# Altium project Micropro_20232.PrjPCB
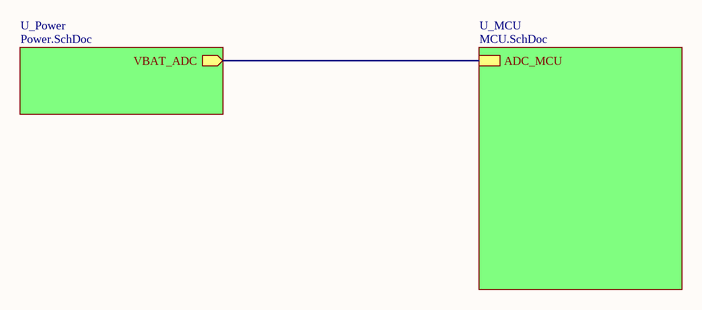
[diagram p0: Mutisheet.SchDoc]
3 sheets, 43 parts. Net scope: hierarchical (ports join the sheet entries above them; power ports are global).
Board file: PCB1.PcbDoc
Sheets:
  Mutisheet.SchDoc
    U_MCU = MCU.SchDoc
    U_Power = Power.SchDoc

## Sheet Mutisheet.SchDoc
size B

### Sub-sheets
U_MCU = MCU.SchDoc: ADC_MCU
U_Power = Power.SchDoc: VBAT_ADC (out)

### Nets
D13_MCU: sheet U_MCU/ADC_MCU, sheet U_Power/VBAT_ADC

## Sheet MCU.SchDoc
size A
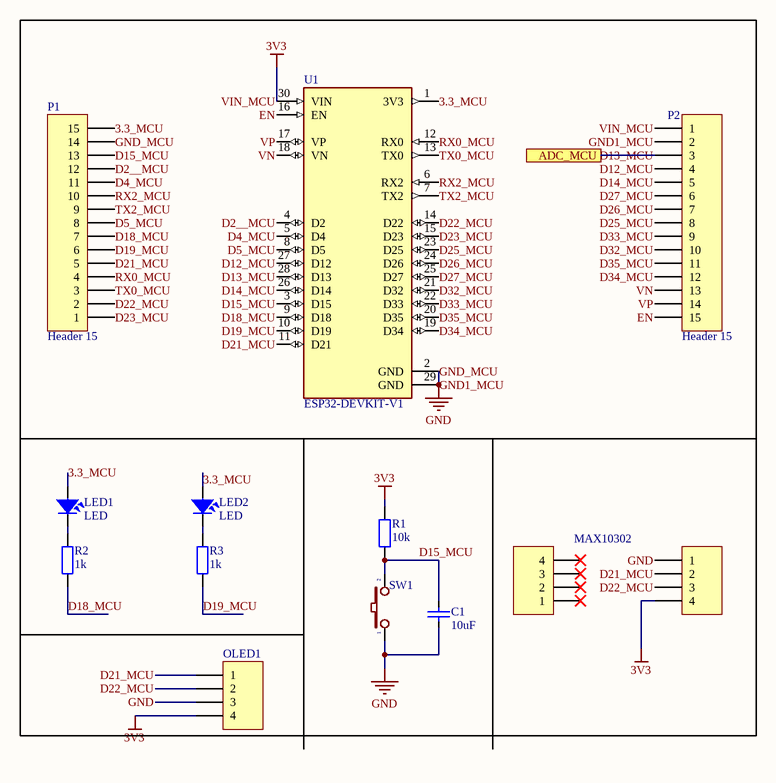
[diagram p1: MCU.SchDoc]

### Parts
C1  10uF  [CAP_0805]
LED1  LED  [LED-0805-Blue]
LED2  LED  [LED-0805-Blue]
MAX10302  Header 4  [HDR1X4]  (value not drawn)
OLED1  LCD  [HDR1X4]  (value not drawn)
P1  Header 15  [HDR1X15]
P2  Header 15  [HDR1X15]
P3  Header 4  [HDR1X4]  (value not drawn)
R1  10k  [RES-SMD-0805]
R2  1k  [RES-SMD-0805]
R3  1k  [RES-SMD-0805]
SW1  SW  [SW2]  (value not drawn)
U1  ESP32-DEVKIT-V1  [MODULE_ESP32_DEVKIT_V1]

### Ports
ADC_MCU

### Nets
GND: C1.1 MAX10302.1 OLED1.3 P1.14 P2.2 SW1.1 U1.2(GND) U1.29(GND)  [also labelled GND1_MCU, GND_MCU]
VIN_MCU: MAX10302.4 OLED1.4 P2.1 R1.1 U1.30(VIN)  [also labelled 3V3]
3.3_MCU: LED1.1 LED2.1 P1.15 U1.1(3V3)
D2__MCU: P1.12 U1.4(D2)
D4_MCU: P1.11 U1.5(D4)
D5_MCU: P1.8 U1.8(D5)
D12_MCU: P2.4 U1.27(D12)
D13_MCU: P2.3 U1.28(D13) ; port ADC_MCU
D14_MCU: P2.5 U1.26(D14)
D15_MCU: C1.2 P1.13 R1.2 SW1.2 U1.3(D15)
D18_MCU: P1.7 R2.2 U1.9(D18)
D19_MCU: P1.6 R3.2 U1.10(D19)
D21_MCU: MAX10302.2 OLED1.1 P1.5 U1.11(D21)
D22_MCU: MAX10302.3 OLED1.2 P1.2 U1.14(D22)
D23_MCU: P1.1 U1.15(D23)
D25_MCU: P2.8 U1.23(D25)
D26_MCU: P2.7 U1.24(D26)
D27_MCU: P2.6 U1.25(D27)
D32_MCU: P2.10 U1.21(D32)
D33_MCU: P2.9 U1.22(D33)
D34_MCU: P2.12 U1.19(D34)
D35_MCU: P2.11 U1.20(D35)
EN: P2.15 U1.16(EN)
RX0_MCU: P1.4 U1.12(RX0)
RX2_MCU: P1.10 U1.6(RX2)
TX0_MCU: P1.3 U1.13(TX0)
TX2_MCU: P1.9 U1.7(TX2)
VN: P2.13 U1.18(VN)
VP: P2.14 U1.17(VP)
NetLED1_2: LED1.2 R2.1
NetLED2_2: LED2.2 R3.1

Not connected (* = marked no-connect by the designer): P3 1* 2* 3* 4*

### Library data of the parts
C1 = CapSMD: Capacitor; Value: 33p; Published: 8-Jun-2000; LatestRevisionDate: 17-Jul-2002; LatestRevisionNote: Re-released for DXP Platform.; PackageReference: RAD-0.3; Publisher: Altium Limited
LED1 LED2 = LED: LED Single colour Green and Red; Value: LED 3 ly Single Colour
MAX10302 OLED1 P3 = Header 4: Header, 4-Pin; LatestRevisionDate: 17-Jul-2002; LatestRevisionNote: Re-released for DXP Platform.; Publisher: Altium Limited
P1 P2 = Header 15: Header, 15-Pin; LatestRevisionDate: 17-Jul-2002; LatestRevisionNote: Re-released for DXP Platform.; Publisher: Altium Limited
R1-R3 = Resistor - SMD: Resistor SMD; Manufacturer: Generic Components; Class: Passive; Published: 08/06/2000; Publisher: Altium Hobart Technology Centre
SW1 = SW2: Switch button 2 pin; Value: SW chip 2 pin
U1 = ESP32-DEVKIT-V1: Dual core, Wi-Fi: 2.4 GHz up to 150 Mbits/s,BLE (Bluetooth Low Energy) and legacy Bluetooth, 32 bits, Up to 240 MHz; MF: Do it; Price: None; Availability: Not in stock; Package: None; MP: ESP32-DEVKIT-V1; Value: *; SnapEDA_Link: https://www.snapeda.com/parts/ESP32-DEVKIT-V1/Do+it/view-part/?ref=snap; Check_prices: https://www.snapeda.com/parts/ESP32-DEVKIT-V1/Do+it/view-part/?ref=eda

## Sheet Power.SchDoc
size B
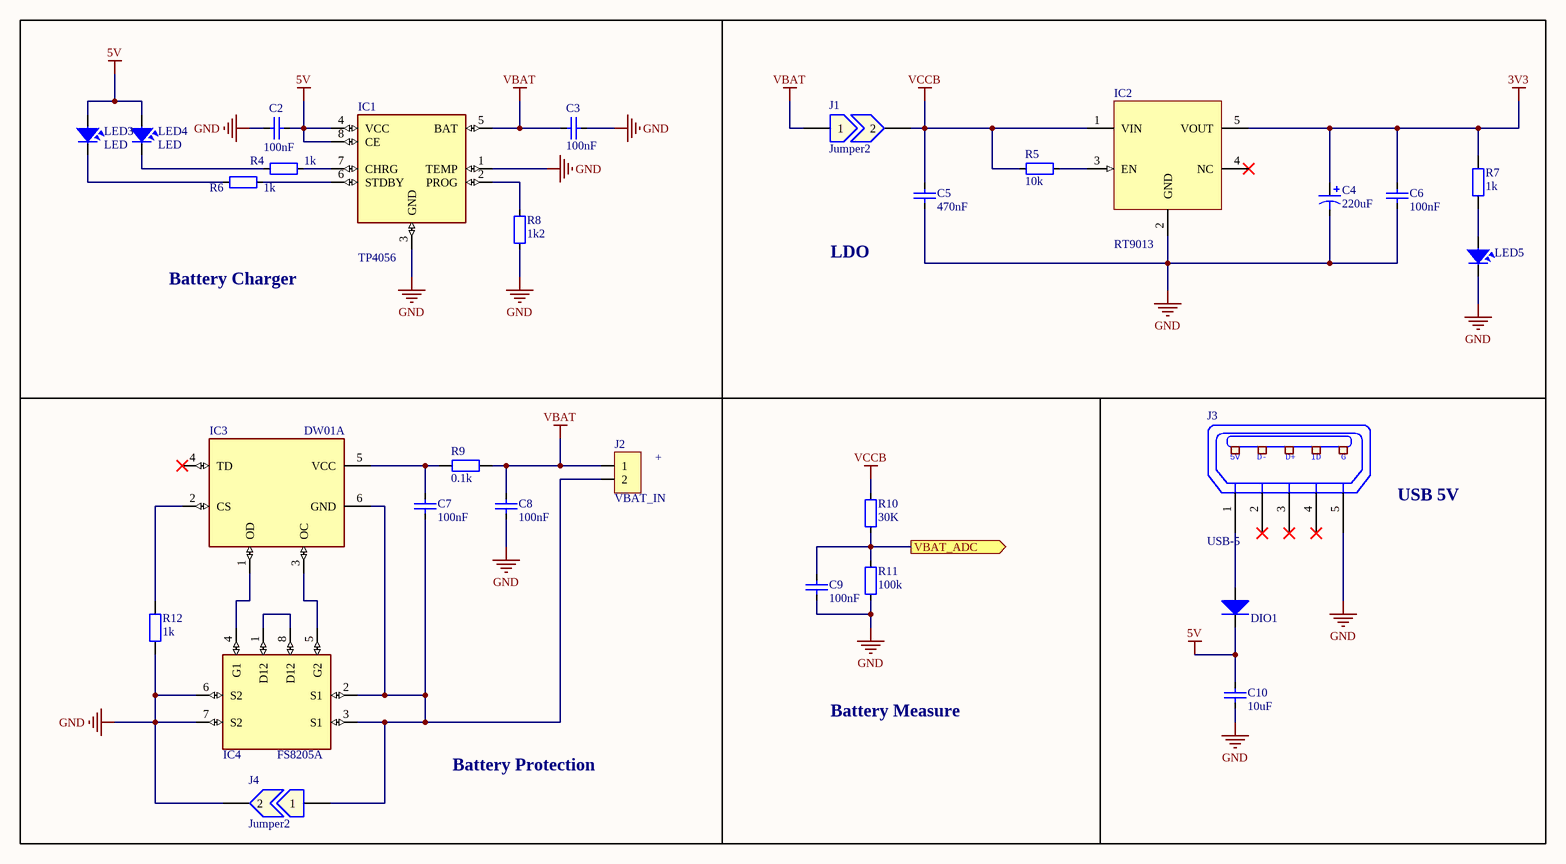
[diagram p2: Power.SchDoc]

### Parts
C2  100nF  [CAP_0805]
C3  100nF  [CAP_0805]
C4  220uF  [CAP_TANTALUM_3216]
C5  470nF  [CAP_0805]
C6  100nF  [CAP_0805]
C7  100nF  [CAP_0805]
C8  100nF  [CAP_0805]
C9  100nF  [CAP_0805]
C10  10uF  [CAP_0805]
DIO1  Diode SMD  [DIO-214AC(SMA)]  (value not drawn)
IC1  TP4056  [TP4056]
IC2  RT9013  [SOT23-5]
IC3  DW01A  [SOT23-6]
IC4  FS8205A  [FS8205A]
J1  Jumper2  [JUMPER2]
J2  VBAT_IN  [JP2-D1T]
J3  USB-5  [USB-M1]
J4  Jumper2  [JUMPER2]
LED3  LED  [LED-0805-Red]
LED4  LED  [LED-0805-Green]
LED5  (no value)  [LED-0805-Red]
R4  1k  [RES-SMD-0805]
R5  10k  [RES-SMD-0805]
R6  1k  [RES-SMD-0805]
R7  1k  [RES-SMD-0805]
R8  1k2  [RES-SMD-0805]
R9  0.1k  [RES-SMD-0805]
R10  30K  [RES-SMD-0805]
R11  100k  [RES-SMD-0805]
R12  1k  [RES-SMD-0805]

### Ports
VBAT_ADC (out)

### Nets
3V3: C4.1 C6.1 IC2.5(VOUT) R7.2  [project net VIN_MCU]
5V: C2.1 C10.2 DIO1.2(K) IC1.4(VCC) IC1.8(CE) LED3.1 LED4.1
GND: C2.2 C3.1 C4.2 C5.2 C6.2 C8.1 C9.1 C10.1 IC1.1(TEMP) IC1.3(GND) IC2.2(GND) IC4.6(S2) IC4.7(S2) J3.5(P5) J4.2 LED5.2 R8.1 R11.2 R12.2
VBAT: C3.2 C8.2 IC1.5(BAT) J1.1 J2.1 R9.2
VCCB: C5.1 IC2.1(VIN) J1.2 R5.2 R10.1
D13_MCU: C9.2 R10.2 R11.1 ; port VBAT_ADC
NetC7_1: C7.1 IC3.6(GND) IC4.2(S1) IC4.3(S1) J2.2 J4.1
NetC7_2: C7.2 IC3.5(VCC) R9.1
NetDIO1_1: DIO1.1(A) J3.1(P1)
NetIC1_2: IC1.2(PROG) R8.2
NetIC1_6: IC1.6(STDBY) R6.1
NetIC1_7: IC1.7(CHRG) R4.1
NetIC2_3: IC2.3(EN) R5.1
NetIC3_1: IC3.1(OD) IC4.4(G1)
NetIC3_2: IC3.2(CS) R12.1
NetIC3_3: IC3.3(OC) IC4.5(G2)
NetIC4_1: IC4.1(D12) IC4.8(D12)
NetLED3_2: LED3.2 R6.2
NetLED4_2: LED4.2 R4.2
NetLED5_1: LED5.1 R7.1

Not connected (* = marked no-connect by the designer): IC2 4(NC)*; IC3 4(TD)*; J3 2(P2)* 3(P3)* 4(P4)*

### Notes on the sheet
- Battery Charger
- LDO
- (near J2) +
- USB 5V
- Battery Measure
- Battery Protection
- (in symbol USB-5) 5V; D-; D+; ID; G

### Library data of the parts
C2 C3 C5-C10 = CapSMD: Capacitor; Value: 33p; Published: 8-Jun-2000; LatestRevisionDate: 17-Jul-2002; LatestRevisionNote: Re-released for DXP Platform.; PackageReference: RAD-0.3; Publisher: Altium Limited
C4 = Cap Pol: Polarized Capacitor (Axial); Published: 8-Jun-2000; LatestRevisionDate: 17-Jul-2002; LatestRevisionNote: Re-released for DXP Platform.; PackageReference: POLAR0.8; Publisher: Altium Limited
DIO1 = Diode SMD: Default Diode; Code - JEDEC: DO-214-AB; Value: 1N5007; Published: 8-Jun-2000; Revision: July-2002: Re-released for DXP Platform.; Publisher: Altium Limited
IC1 = TP4056: Complete single cell Li-Ion battery with a constant current / constant voltage linear charger
IC2 = RT9013: https://linhkien.cxt.vn/5435-rt9013-33gb-ic-reg-linear-33v-500ma-sot23-5.html
IC3 = DW01A: One Cell Lithium-ion/Polymer Battery Protection IC
J1 J4 = Jumper2: Jumper, 2-Pin
J2 = JP2: WR-PHD 2.54 mm Angled Socket Header; Manufacturer: W¨¹rth Elektronik eiSos GmbH; partNo: 613002143121; ComponentLink1 Description: Manufacturer; ComponentLink2 Description: Datasheet; NoPins: 02; Created Date: 29 March 2013; ComponentLink1URL: http://www.we-online.com; ComponentLink2URL: http://katalog.we-online.de/em/datasheet/6130xx143121.pdf; Created by: Karrer Zheng
J3 = USB-5: Manufacturer: FCI; Manufacturer Part Number: 10118193-0001LF; Connector Type: USB - micro B; Number of Contacts: 5; Gender: Receptacle; Specifications: USB 2.0; .Creator: MM; .Checked PCB: RF; Supplier 1: Digi-Key; RoHS: RoHS Compliant; Category: Connectors, Interconnects; Stock 1: 28642; Pricing 1: 1=0.46, 10=0.433, 25=0.3712, 50=0.3156, 100=0.3032, 250=0.27224, 500=0.25988 (USD); Packaging: Cut Tape (CT); Mounting Type: Surface Mount, Right Angle, Horizontal; Features: Shielded, Solder Retention; Ingress Protection: -; ComponentLink1URL: http://portal.fciconnect.com/Comergent//fci/drawing/10118193.pdf; ComponentLink1Description: http://portal.fciconnect.com/Comergent//fci/drawing/10118193.pdf; Supplier Part Number 1: 609-4616-1-ND; .Checked SCH: MM
LED3-LED5 = LED: as LED1 on sheet MCU
R4-R6 R8 R10 R11 = Resistor - SMD: Resistor; Manufacturer: Generic Components; Class: Passive; Published: 08/06/2000; Publisher: Altium Hobart Technology Centre
R7 R9 R12 = Resistor - SMD: as R1 on sheet MCU; Published: 08/06/2000; Publisher: Altium Hobart Technology Centre

## Nets that join several sheets
GND: MCU (8 pins), Power (19 pins)
VIN_MCU: MCU (5 pins), Power (C4.1 C6.1 IC2.5 R7.2)
D13_MCU: MCU (P2.3 U1.28), Power (C9.2 R10.2 R11.1)